# EAGLE design attiny85_0812_2016 (EAGLE 7.6.0)
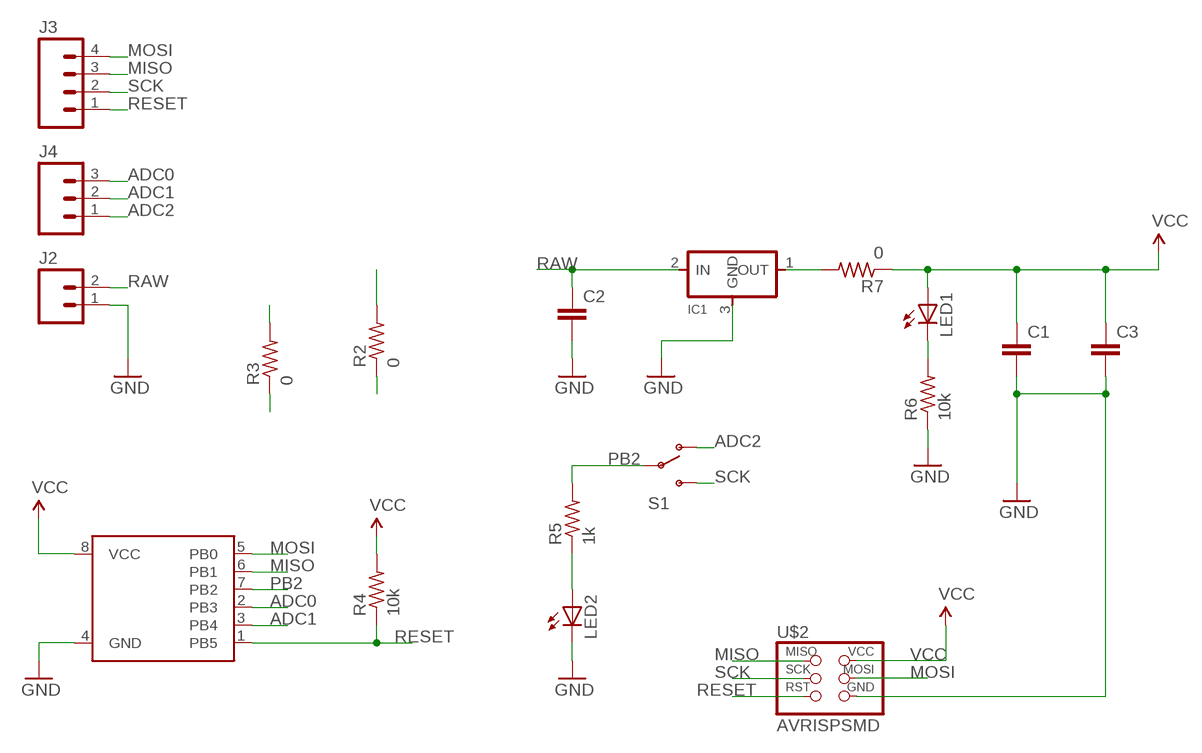
[diagram p0: schematic, sheet 1]

## Parts
C1  CAP1206  [1206]
C2  CAP1206  [1206]
C3  CAP1206  [1206]
IC1  REGULATORSOT23  [SOT23]
J2  M02PTH  [1X02]
J3  M04NO_SILK_ALL_ROUND  [1X04_NO_SILK_ALL_ROUND]
J4  M03PTH  [1X03]
LED1  LEDCHIPLED_1206  [CHIPLED_1206]
LED2  LEDCHIPLED_1206  [CHIPLED_1206]
R2  0  RES-US1206FAB  [R1206FAB]
R3  0  RES-US1206FAB  [R1206FAB]
R4  10k  RES-US1206FAB  [R1206FAB]
R5  1k  RES-US1206FAB  [R1206FAB]
R6  10k  RES-US1206FAB  [R1206FAB]
R7  0  RES-US1206FAB  [R1206FAB]
S1  SWITCH-SPDTPTH  [SWITCH-SPDT]
U$1  ATTINY85EIAJ  [8S2_EIAJ-85]
U$2  AVRISPSMD  [2X03SMD]

## Nets
ADC0: J4.3 U$1.2(PB3)
ADC1: J4.2 U$1.3(PB4)
ADC2: J4.1 S1.1(O)
GND: C1.2 C2.2 C3.2 IC1.3(GND) J2.1 LED2.C R6.1 U$1.4(GND) U$2.6(GND)
MISO: J3.3 U$1.6(PB1) U$2.1(MISO)
MOSI: J3.4 R3.1 R3.2 U$1.5(PB0) U$2.4(MOSI)
N$2: IC1.1(OUT) R7.2
N$3: LED1.C R6.2
N$4: LED2.A R5.1
PB2: R5.2 S1.2(P) U$1.7(PB2)
RAW: C2.1 IC1.2(IN) J2.2
RESET: J3.1 R4.1 U$1.1(PB5) U$2.5(RST)
SCK: J3.2 S1.3(S) U$2.3(SCK)
VCC: C1.1 C3.1 LED1.A R2.1 R2.2 R4.2 R7.1 U$1.8(VCC) U$2.2(VCC)

## Library data of the parts
C1-C3 = SparkFun-Capacitors:CAP: Capacitor Standard 0603 ceramic capacitor, and 0.1" leaded capacitor.
IC1 = fab:REGULATOR
J2 = SparkFun-Connectors:M02: Standard 2-pin 0.1" header. Use with - straight break away headers ( PRT-00116) - right angle break away headers (PRT-00553) - swiss pins (PRT-00743) - machine pins (PRT-00117) - female headers (PRT-00115) Molex polarized connector foot print use with: PRT-08233 with associated crimp pins and housings. 2.54_SCREWTERM for use with PRT-10571. 3.5mm Screw Terminal footprints for PRT-08084 5mm Screw Terminal footprints for use with PRT-08432
J3 = SparkFun-Connectors:M04: Header 4 Standard 4-pin 0.1" header. Use with straight break away headers (SKU : PRT-00116), right angle break away headers (PRT-00553), swiss pins (PRT-00743), machine pins (PRT-00117), and female headers (PRT-00115). Molex polarized connector foot print use with SKU : PRT-08231 with associated crimp pins and housings. 1MM SMD Version SKU: PRT-10208; PROD_ID: CONN-09696
J4 = SparkFun-Connectors:M03: Header 3 Standard 3-pin 0.1" header. Use with straight break away headers (SKU : PRT-00116), right angle break away headers (PRT-00553), swiss pins (PRT-00743), machine pins (PRT-00117), and female headers (PRT-00115). Molex polarized connector foot print use with SKU : PRT-08232 with associated crimp pins and housings.
LED1 LED2 = led:LED: LED OSRAM: - CHIPLED LG R971, LG N971, LY N971, LG Q971, LY Q971, LO R971, LY R971 LH N974, LH R974 LS Q976, LO Q976, LY Q976 LO Q996 - Hyper CHIPLED LW Q18S LB Q993, LB Q99A, LB R99A - SideLED LS A670, LO A670, LY A670, LG A670, LP A670 LB A673, LV A673, LT A673, LW A673 LH A674 LY A675 LS A676, LA A676, LO A676, LY A676, LW A676 LS A679, LY A679, LG A679 - Hyper Micro SIDELED® LS Y876, LA Y876, LO Y876, LY Y876 LT Y87S - SmartLED LW L88C, LW L88S LB L89C, LB L89S, LG L890 LS L89K, LO L89K, LY L89K LS L896, LA L896, LO L896, LY L896 - TOPLED LS T670, LO T670, LY T670, LG T670, LP T670 LSG T670, LSP T670, LSY T670, LOP T670, LYG T670 LG T671, LOG T671, LSG T671 LB T673, LV T673, LT T673, LW T673 LH T674 LS T676, LA T676, LO T676, LY T676, LB T676, LH T676, LSB T676, LW T676 LB T67C, LV T67C, LT T67C, LS T67K, LO T67K, LY T67K, LW E67C LS E67B, LA E67B, LO E67B, LY E67B, LB E67C, LV E67C, LT E67C LW T67C LS T679, LY T679, LG T679 LS T770, LO T770, LY T770, LG T770, LP T770 LB T773, LV T773, LT T773, LW T773 LH T774 LS E675, LA E675, LY E675, LS T675 LS T776, LA T776, LO T776, LY T776, LB T776 LHGB T686 LT T68C, LB T68C - Hyper Mini TOPLED® LB M676 - Mini TOPLED Santana® LG M470 LS M47K, LO M47K, LY M47K Source: http://www.osram.convergy.de LUXEON: - LUMILED® LXK2-PW12-R00, LXK2-PW12-S00, LXK2-PW14-U00, LXK2-PW14-V00 LXK2-PM12-R00, LXK2-PM12-S00, LXK2-PM14-U00 LXK2-PE12-Q00, LXK2-PE12-R00, LXK2-PE12-S00, LXK2-PE14-T00, LXK2-PE14-U00 LXK2-PB12-K00, LXK2-PB12-L00, LXK2-PB12-M00, LXK2-PB14-N00, LXK2-PB14-P00, LXK2-PB14-Q00 LXK2-PR12-L00, LXK2-PR12-M00, LXK2-PR14-Q00, LXK2-PR14-R00 LXK2-PD12-Q00, LXK2-PD12-R00, LXK2-PD12-S00 LXK2-PH12-R00, LXK2-PH12-S00 LXK2-PL12-P00, LXK2-PL12-Q00, LXK2-PL12-R00 Source: www.luxeon.com KINGBRIGHT: KA-3528ASYC Source: www.kingbright.com
R2-R7 = fab:RES-US: Resistor (US Symbol) Variants with postfix FAB are widened to allow the routing of internal traces
S1 = SparkFun-Electromechanical:SWITCH-SPDT: SPDT Switch Simple slide switch, Spark Fun Electronics SKU : COM-00102 DPDT SMT slide switch, AYZ0202, SWCH-08179; PROD_ID: SWCH-08261
U$1 = SparkFun-DigitalIC:ATTINY85
U$2 = fab:AVRISP

## Board
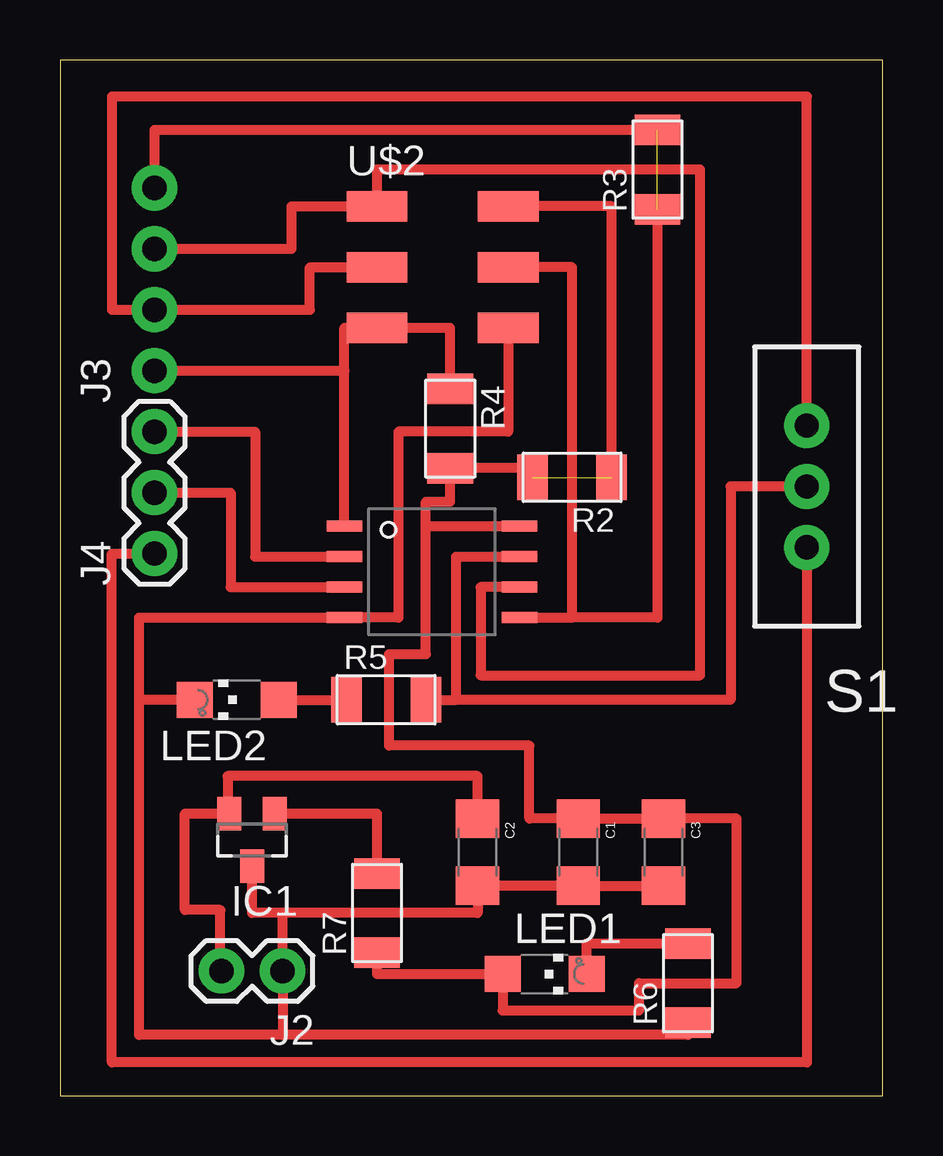
[diagram p1: board, top side]

Size 34.29 x 43.18 mm. Coordinates in mm from the lower left corner, seen from the top.
Outline: 0,0 34.29,0 34.29,43.18 0,43.18 0,0
Copper layers (1*16): Top 0.035mm / dielectric 1.5mm / Bottom 0.035mm
Design rules "default": minimum track width 10mil, minimum drill 24mil, track to track 8mil, track to pad 8mil, pad to pad 8mil, via to via 8mil, smd to smd 8mil, copper to edge 40mil, drill to drill 8mil, minimum pad ring 10mil, minimum via ring 8mil, stop-mask expansion 4mil, vias tented up to drill 0mil, thermal gap 10mil

### Footprints (pad centres in the part's own frame; a part is rotated, then mirrored left to right if it is on the bottom)
1206 = smd 1.6 x 1.8: 1 -1.4,0; 2 1.4,0
SOT23 = smd 1 x 1.4: 1 -0.95,-1.1; 2 0.95,-1.1; 3 0,1.1
1X02 = drill 1.016 pad 1.88: 1 0,0; 2 2.54,0
1X04_NO_SILK_ALL_ROUND = drill 1.016 pad 1.88: 1 0,0; 2 2.54,0; 3 5.08,0; 4 7.62,0
1X03 = drill 1.016 pad 1.88: 1 0,0; 2 2.54,0; 3 5.08,0
CHIPLED_1206 = smd 1.5 x 1.5: A 0,-1.75; C 0,1.75
R1206FAB = smd 1.27 x 1.905: 1 -1.651,0; 2 1.651,0
SWITCH-SPDT = drill 1.016 pad 1.88: 1 0,2.54; 2 0,0; 3 0,-2.54
8S2_EIAJ-85 = smd 0.457 x 1.48: 1 1.905,3.65; 2 0.635,3.65; 3 -0.635,3.65; 4 -1.905,3.65; 5 -1.905,-3.65; 6 -0.635,-3.65; 7 0.635,-3.65; 8 1.905,-3.65
2X03SMD = smd 2.54 x 1.27: 1 -2.54,2.54; 2 2.92,2.54; 3 -2.54,0; 4 2.92,0; 5 -2.54,-2.54; 6 2.92,-2.54

### Placement (x,y rotation side)
C1  21.59,10.16 270 top
C2  17.4,10.16 270 top
C3  25.15,10.16 270 top
IC1  8,10.67 180 top
J2  9.27,5.21 180 top
J3  3.94,30.23 90 top
J4  3.94,22.61 90 top
LED1  20.19,5.08 270 top
LED2  7.37,16.51 90 top
R2  21.34,25.78 180 top
R3  24.89,38.61 90 top
R4  16.26,27.81 270 top
R5  13.59,16.51 0 top
R6  26.16,4.7 90 top
R7  13.21,7.62 90 top
S1  31.11,25.4 180 top
U$1  15.49,21.84 90 top
U$2  15.75,34.54 0 top

### Tracks (layer width: path | path; a pad name or v marks a point on that pad's centre or on a via)
ADC0
  Top 0.406: J4.3 8.13,27.69 8.13,22.48 U$1.2
ADC1
  Top 0.406: J4.2 7.11,25.15 7.11,21.21 U$1.3
ADC2
  Top 0.406: S1.1 31.11,1.4 2.16,1.4 2.16,22.61 J4.1
GND
  Top 0.406: IC1.3 8,7.62 9.27,7.62 | 9.27,7.62 17.4,7.62 C2.2 C1.2 C3.2 | R6.1 26.16,2.54 9.27,2.54 | 9.27,2.54 3.3,2.54 3.3,16.51 | 3.3,16.51 3.3,19.94 U$1.4 14.1,19.94 14.1,27.69 18.67,27.69 U$2.6 | 9.27,2.54 J2.1 9.27,7.62 | LED2.C 3.3,16.51
MISO
  Top 0.406: J3.3 9.65,35.31 9.65,37.08 U$2.1 13.21,38.61 26.67,38.61 26.67,17.53 17.53,17.53 17.53,21.21 U$1.6
MOSI  (1 unrouted)
  Top 0.406: 18.67,34.42 U$2.4 21.34,34.54 21.34,19.94 | U$1.5 21.34,19.94 | R3.1 24.89,19.94 21.34,19.94 | R3.2 3.94,40.26 J3.4
N$2
  Top 0.406: IC1.1 13.21,11.77 R7.2
N$3
  Top 0.406: LED1.C 21.94,6.35 R6.2
N$4
  Top 0.406: LED2.A R5.1
PB2
  Top 0.406: R5.2 16.51,16.51 | 16.51,16.51 16.51,22.48 U$1.7 | S1.2 27.94,25.4 27.94,16.51 16.51,16.51
RAW
  Top 0.406: C2.1 17.4,13.34 6.99,13.34 6.99,11.77 IC1.2 5.21,11.77 5.21,7.75 6.68,7.75 6.68,5.21 J2.2
RESET
  Top 0.406: U$1.1 11.84,30.23 | 11.84,30.23 11.84,32 U$2.5 16.26,32 R4.1 | J3.1 11.84,30.23
SCK
  Top 0.406: U$2.3 10.41,34.54 10.41,32.77 J3.2 2.16,32.77 2.16,41.66 31.11,41.66 S1.3
VCC  (1 unrouted)
  Top 0.406: R7.1 13.21,5.08 LED1.A 18.44,3.56 24.13,3.56 24.13,4.7 28.19,4.7 28.19,11.56 C3.1 C1.1 19.56,11.56 19.56,14.61 13.72,14.61 13.72,18.41 15.24,18.41 15.24,23.75 | 15.24,23.75 U$1.8 | 15.24,23.75 15.24,24.77 16.26,24.77 R4.2 19.68,26.16 R2.2 | R2.1 22.99,37.08 U$2.2